# EasyEDA schematic circuitDiagramEasyEDA.json
TITLE: Wireless Light Switch; REV: 1.0; Date: 2020-10-18; Sheet: 1/1; Drawn By: KZ; Company: KZ
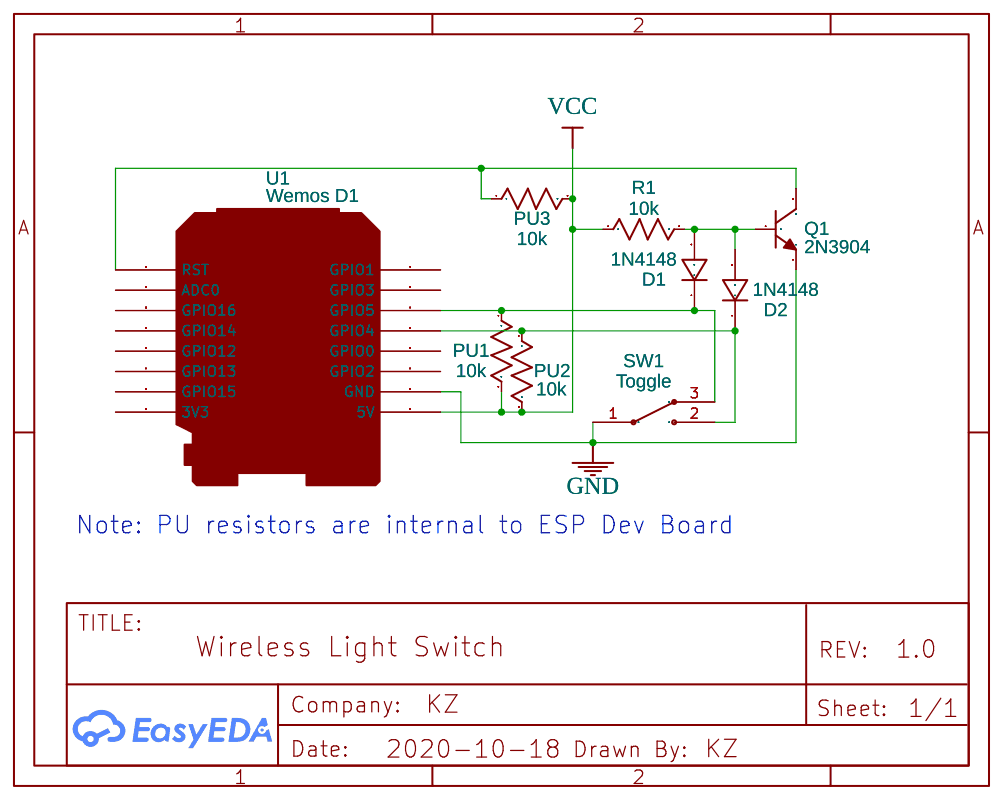
[diagram p0: schematic sheet]

## Parts
D1  1N4148  [SOD-123_L2.8-W1.8-LS3.7-RD]
D2  1N4148  [SOD-123_L2.8-W1.8-LS3.7-RD]
PU1  10k  [R0603]
PU2  10k  [R0603]
PU3  10k  [R0603]
Q1  2N3904  [TO-92-3_L5.1-W4.1-P1.27-L]
R1  10k  [R0603]
SW1  Toggle  [SW-SMD_MSK-11027]
U1  Wemos D1  [WEMOS_D1_MINI_V2.3.0]

## Library data of the parts
D1 D2 = 1N4007W: Supplier: LCSC; Supplier Part: C328592; Manufacturer: BLUE ROCKET; Contributor: LCEDA_Lib
PU1-PU3 R1 = R_0603_US: Contributor: LCEDA_Lib
Q1 = 2N3904: Supplier: LCSC; Manufacturer: SEMTECH; Supplier Part: C118538
SW1 = MSK-11027 Toggle Switches: Supplier Part: C21381; Supplier: LCSC; Manufacturer: ReliaPro; image: http://image.lceda.cn/szlcsc/C21381.jpg
U1 = Wemos D1: Manufacturer: Wemos; Contributor: romax.job

## Nets
GND: Q1.1(E) SW1.1(2) U1.GND
VCC: PU1.2 PU2.2 PU3.2 R1.1 U1.5V
Net-(D1-1): D1.1 PU1.1 SW1.3 U1.D1(GPIO5)
Net-(D1-2): D1.2 D2.2 Q1.2(B) R1.2
Net-(D2-1): D2.1 PU2.1 SW1.2(1) U1.D2(GPIO14)
Net-(PU3-1): PU3.1 Q1.3(C) U1.RST

Not connected (* = marked no-connect by the designer): U1 3V3 A0(ADC0) D0(GPIO16) D3(GPIO0) D4(GPIO2) D6(GPIO12) D7(GPIO13) D8(GPIO15) RX(GPIO3) TX(GPIO1)

## Notes on the sheet
- Note: PU resistors are internal to ESP Dev Board
